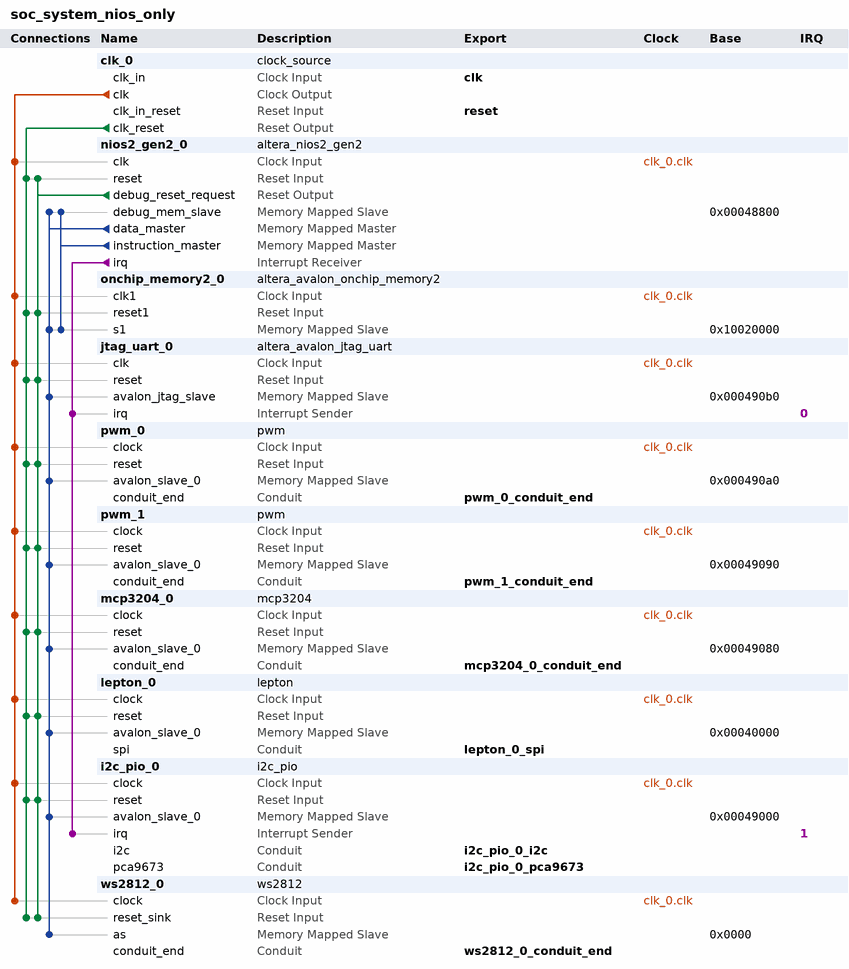
[diagram p0: system contents]
# Platform Designer (Qsys) system soc_system_nios_only, Cyclone V 5CSEMA4U23C6
# Parameters at their usual value, and those the tool derives, are not listed.
package require -exact qsys 16.0
create_system soc_system_nios_only
set_project_property DEVICE_FAMILY {Cyclone V}
set_project_property DEVICE 5CSEMA4U23C6

add_instance clk_0 clock_source 16.0
set_instance_parameter_value clk_0 clockFrequency 50000000

add_instance nios2_gen2_0 altera_nios2_gen2 16.0
set_instance_parameter_value nios2_gen2_0 dcache_size 2048
set_instance_parameter_value nios2_gen2_0 exceptionSlave onchip_memory2_0.s1
set_instance_parameter_value nios2_gen2_0 icache_size 4096
set_instance_parameter_value nios2_gen2_0 impl Fast
set_instance_parameter_value nios2_gen2_0 resetSlave onchip_memory2_0.s1

add_instance onchip_memory2_0 altera_avalon_onchip_memory2 16.0
set_instance_parameter_value onchip_memory2_0 dataWidth 32
set_instance_parameter_value onchip_memory2_0 dualPort false
set_instance_parameter_value onchip_memory2_0 initMemContent true
set_instance_parameter_value onchip_memory2_0 initializationFileName onchip_mem.hex
set_instance_parameter_value onchip_memory2_0 memorySize 131072

add_instance jtag_uart_0 altera_avalon_jtag_uart 16.0
set_instance_parameter_value jtag_uart_0 simInteractiveOptions NO_INTERACTIVE_WINDOWS

add_instance pwm_0 pwm 1.0

add_instance pwm_1 pwm 1.0

add_instance mcp3204_0 mcp3204 1.0

add_instance lepton_0 lepton 15.1

add_instance i2c_pio_0 i2c_pio 15.1
set_instance_parameter_value i2c_pio_0 CLK_FREQ 50000000
set_instance_parameter_value i2c_pio_0 I2C_ADDR 72
set_instance_parameter_value i2c_pio_0 PORT_LEN 4
set_instance_parameter_value i2c_pio_0 SCL_FREQ 100000

add_instance ws2812_0 ws2812 16.0
set_instance_parameter_value ws2812_0 ADDR_WIDTH 3
set_instance_parameter_value ws2812_0 LUMINOSITY 4
set_instance_parameter_value ws2812_0 NUMBER_LEDS 1

# connections
add_connection clk_0.clk i2c_pio_0.clock clock
add_connection clk_0.clk jtag_uart_0.clk clock
add_connection clk_0.clk lepton_0.clock clock
add_connection clk_0.clk mcp3204_0.clock clock
add_connection clk_0.clk nios2_gen2_0.clk clock
add_connection clk_0.clk onchip_memory2_0.clk1 clock
add_connection clk_0.clk pwm_0.clock clock
add_connection clk_0.clk pwm_1.clock clock
add_connection clk_0.clk ws2812_0.clock clock
add_connection clk_0.clk_reset i2c_pio_0.reset reset
add_connection clk_0.clk_reset jtag_uart_0.reset reset
add_connection clk_0.clk_reset lepton_0.reset reset
add_connection clk_0.clk_reset mcp3204_0.reset reset
add_connection clk_0.clk_reset nios2_gen2_0.reset reset
add_connection clk_0.clk_reset onchip_memory2_0.reset1 reset
add_connection clk_0.clk_reset pwm_0.reset reset
add_connection clk_0.clk_reset pwm_1.reset reset
add_connection clk_0.clk_reset ws2812_0.reset_sink reset
add_connection nios2_gen2_0.debug_reset_request i2c_pio_0.reset reset
add_connection nios2_gen2_0.debug_reset_request jtag_uart_0.reset reset
add_connection nios2_gen2_0.debug_reset_request lepton_0.reset reset
add_connection nios2_gen2_0.debug_reset_request mcp3204_0.reset reset
add_connection nios2_gen2_0.debug_reset_request nios2_gen2_0.reset reset
add_connection nios2_gen2_0.debug_reset_request onchip_memory2_0.reset1 reset
add_connection nios2_gen2_0.debug_reset_request pwm_0.reset reset
add_connection nios2_gen2_0.debug_reset_request pwm_1.reset reset
add_connection nios2_gen2_0.debug_reset_request ws2812_0.reset_sink reset
add_connection nios2_gen2_0.data_master i2c_pio_0.avalon_slave_0 avalon
set_connection_parameter_value nios2_gen2_0.data_master/i2c_pio_0.avalon_slave_0 baseAddress 0x00049000
add_connection nios2_gen2_0.data_master jtag_uart_0.avalon_jtag_slave avalon
set_connection_parameter_value nios2_gen2_0.data_master/jtag_uart_0.avalon_jtag_slave baseAddress 0x000490b0
add_connection nios2_gen2_0.data_master lepton_0.avalon_slave_0 avalon
set_connection_parameter_value nios2_gen2_0.data_master/lepton_0.avalon_slave_0 baseAddress 0x00040000
add_connection nios2_gen2_0.data_master mcp3204_0.avalon_slave_0 avalon
set_connection_parameter_value nios2_gen2_0.data_master/mcp3204_0.avalon_slave_0 baseAddress 0x00049080
add_connection nios2_gen2_0.data_master nios2_gen2_0.debug_mem_slave avalon
set_connection_parameter_value nios2_gen2_0.data_master/nios2_gen2_0.debug_mem_slave baseAddress 0x00048800
add_connection nios2_gen2_0.data_master onchip_memory2_0.s1 avalon
set_connection_parameter_value nios2_gen2_0.data_master/onchip_memory2_0.s1 baseAddress 0x10020000
add_connection nios2_gen2_0.data_master pwm_0.avalon_slave_0 avalon
set_connection_parameter_value nios2_gen2_0.data_master/pwm_0.avalon_slave_0 baseAddress 0x000490a0
add_connection nios2_gen2_0.data_master pwm_1.avalon_slave_0 avalon
set_connection_parameter_value nios2_gen2_0.data_master/pwm_1.avalon_slave_0 baseAddress 0x00049090
add_connection nios2_gen2_0.data_master ws2812_0.as avalon
set_connection_parameter_value nios2_gen2_0.data_master/ws2812_0.as baseAddress 0x0000
add_connection nios2_gen2_0.instruction_master nios2_gen2_0.debug_mem_slave avalon
set_connection_parameter_value nios2_gen2_0.instruction_master/nios2_gen2_0.debug_mem_slave baseAddress 0x00048800
add_connection nios2_gen2_0.instruction_master onchip_memory2_0.s1 avalon
set_connection_parameter_value nios2_gen2_0.instruction_master/onchip_memory2_0.s1 baseAddress 0x10020000
add_connection nios2_gen2_0.irq i2c_pio_0.irq interrupt
set_connection_parameter_value nios2_gen2_0.irq/i2c_pio_0.irq irqNumber 1
add_connection nios2_gen2_0.irq jtag_uart_0.irq interrupt
set_connection_parameter_value nios2_gen2_0.irq/jtag_uart_0.irq irqNumber 0

# exported interfaces
add_interface clk clock sink
set_interface_property clk EXPORT_OF clk_0.clk_in
add_interface i2c_pio_0_i2c conduit end
set_interface_property i2c_pio_0_i2c EXPORT_OF i2c_pio_0.i2c
add_interface i2c_pio_0_pca9673 conduit end
set_interface_property i2c_pio_0_pca9673 EXPORT_OF i2c_pio_0.pca9673
add_interface lepton_0_spi conduit end
set_interface_property lepton_0_spi EXPORT_OF lepton_0.spi
add_interface mcp3204_0_conduit_end conduit end
set_interface_property mcp3204_0_conduit_end EXPORT_OF mcp3204_0.conduit_end
add_interface pwm_0_conduit_end conduit end
set_interface_property pwm_0_conduit_end EXPORT_OF pwm_0.conduit_end
add_interface pwm_1_conduit_end conduit end
set_interface_property pwm_1_conduit_end EXPORT_OF pwm_1.conduit_end
add_interface reset reset sink
set_interface_property reset EXPORT_OF clk_0.clk_in_reset
add_interface ws2812_0_conduit_end conduit end
set_interface_property ws2812_0_conduit_end EXPORT_OF ws2812_0.conduit_end

set_interconnect_requirement {$system} qsys_mm.clockCrossingAdapter HANDSHAKE
set_interconnect_requirement {$system} qsys_mm.enableEccProtection FALSE
set_interconnect_requirement {$system} qsys_mm.insertDefaultSlave FALSE
set_interconnect_requirement {$system} qsys_mm.maxAdditionalLatency 1

save_system soc_system_nios_only.qsys
